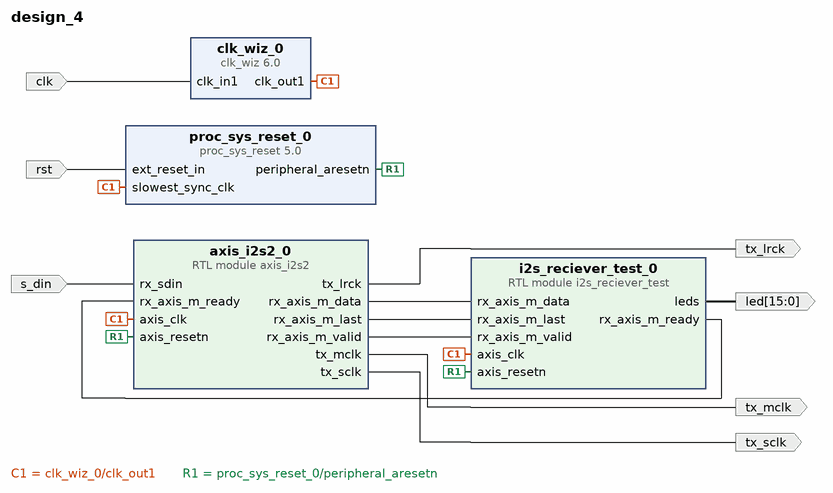
[diagram p0: block diagram of the top level]
# Vivado block design design_4, xc7z020clg400-1, Vivado 2025.2
create_bd_design design_4

create_bd_port -dir I -type clk clk
set_property -dict {CONFIG.FREQ_HZ 100000000} [get_bd_ports clk]
create_bd_port -dir I -type rst rst
set_property -dict {CONFIG.POLARITY ACTIVE_HIGH} [get_bd_ports rst]
create_bd_port -dir I s_din
create_bd_port -dir O tx_lrck
create_bd_port -dir O tx_mclk
create_bd_port -dir O tx_sclk
create_bd_port -dir O -from 15 -to 0 led

create_bd_cell -type module -reference axis_i2s2 axis_i2s2_0
create_bd_cell -type ip -vlnv xilinx.com:ip:clk_wiz:6.0 clk_wiz_0
set_property -dict [list \
  CONFIG.CLKOUT1_JITTER 629.510 \
  CONFIG.CLKOUT1_PHASE_ERROR 767.789 \
  CONFIG.CLKOUT1_REQUESTED_OUT_FREQ 22.5792 \
  CONFIG.MMCM_CLKFBOUT_MULT_F 63.250 \
  CONFIG.MMCM_CLKOUT0_DIVIDE_F 31.125 \
  CONFIG.MMCM_DIVCLK_DIVIDE 9 \
  CONFIG.PRIM_SOURCE Global_buffer \
] [get_bd_cells clk_wiz_0]
create_bd_cell -type ip -vlnv xilinx.com:ip:proc_sys_reset:5.0 proc_sys_reset_0
set_property -dict {CONFIG.C_AUX_RST_WIDTH 1 CONFIG.C_EXT_RST_WIDTH 1} [get_bd_cells proc_sys_reset_0]
create_bd_cell -type module -reference i2s_reciever_test i2s_reciever_test_0

# ---- connections ----

connect_bd_net [get_bd_pins axis_i2s2_0/rx_axis_m_data] [get_bd_pins i2s_reciever_test_0/rx_axis_m_data]
connect_bd_net [get_bd_pins axis_i2s2_0/rx_axis_m_last] [get_bd_pins i2s_reciever_test_0/rx_axis_m_last]
connect_bd_net [get_bd_pins axis_i2s2_0/rx_axis_m_valid] [get_bd_pins i2s_reciever_test_0/rx_axis_m_valid]
connect_bd_net [get_bd_pins axis_i2s2_0/tx_lrck] [get_bd_ports tx_lrck]
connect_bd_net [get_bd_pins axis_i2s2_0/tx_mclk] [get_bd_ports tx_mclk]
connect_bd_net [get_bd_pins axis_i2s2_0/tx_sclk] [get_bd_ports tx_sclk]
connect_bd_net [get_bd_ports clk] [get_bd_pins clk_wiz_0/clk_in1]
connect_bd_net [get_bd_pins clk_wiz_0/clk_out1] \
  [get_bd_pins axis_i2s2_0/axis_clk] [get_bd_pins i2s_reciever_test_0/axis_clk] \
  [get_bd_pins proc_sys_reset_0/slowest_sync_clk]
connect_bd_net -net i2s_reciever_test_0_led_clk [get_bd_pins i2s_reciever_test_0/leds] [get_bd_ports led]
connect_bd_net [get_bd_pins i2s_reciever_test_0/rx_axis_m_ready] [get_bd_pins axis_i2s2_0/rx_axis_m_ready]
connect_bd_net [get_bd_pins proc_sys_reset_0/peripheral_aresetn] [get_bd_pins axis_i2s2_0/axis_resetn] [get_bd_pins i2s_reciever_test_0/axis_resetn]
connect_bd_net [get_bd_ports rst] [get_bd_pins proc_sys_reset_0/ext_reset_in]
connect_bd_net [get_bd_ports s_din] [get_bd_pins axis_i2s2_0/rx_sdin]

validate_bd_design
save_bd_design
